# Altium schematic sheet MCU025B_XDS110_MCU.SchDoc
size 431 x 279 mm; PageSetup: Record=PageOptions|CenterHorizontal=True|CenterVertical=True|PrintScale=1.00|XCorrection=1.00|YCorrection=1.00|PrintKind=0|BorderSize=5000000|LeftOffset=0|BottomOffset=0|Orientation=2|PaperLength=1000|PaperWidth=1000|Scale=100|PaperSource=15|PrintQuality=600|MediaType=1|DitherType=10|PaperKind=Letter|PrintScaleMode=1; Organization: ORGANIZATION; Address1: ADDRESS 1; Address2: ADDRESS 2; Address3: ADDRESS 3; Address4: ADDRESS 4; Revision: -; ENG_APP_DATE: --/--/--; DSN_APP_DATE: --/--/--; CHK_APP_DATE: --/--/--
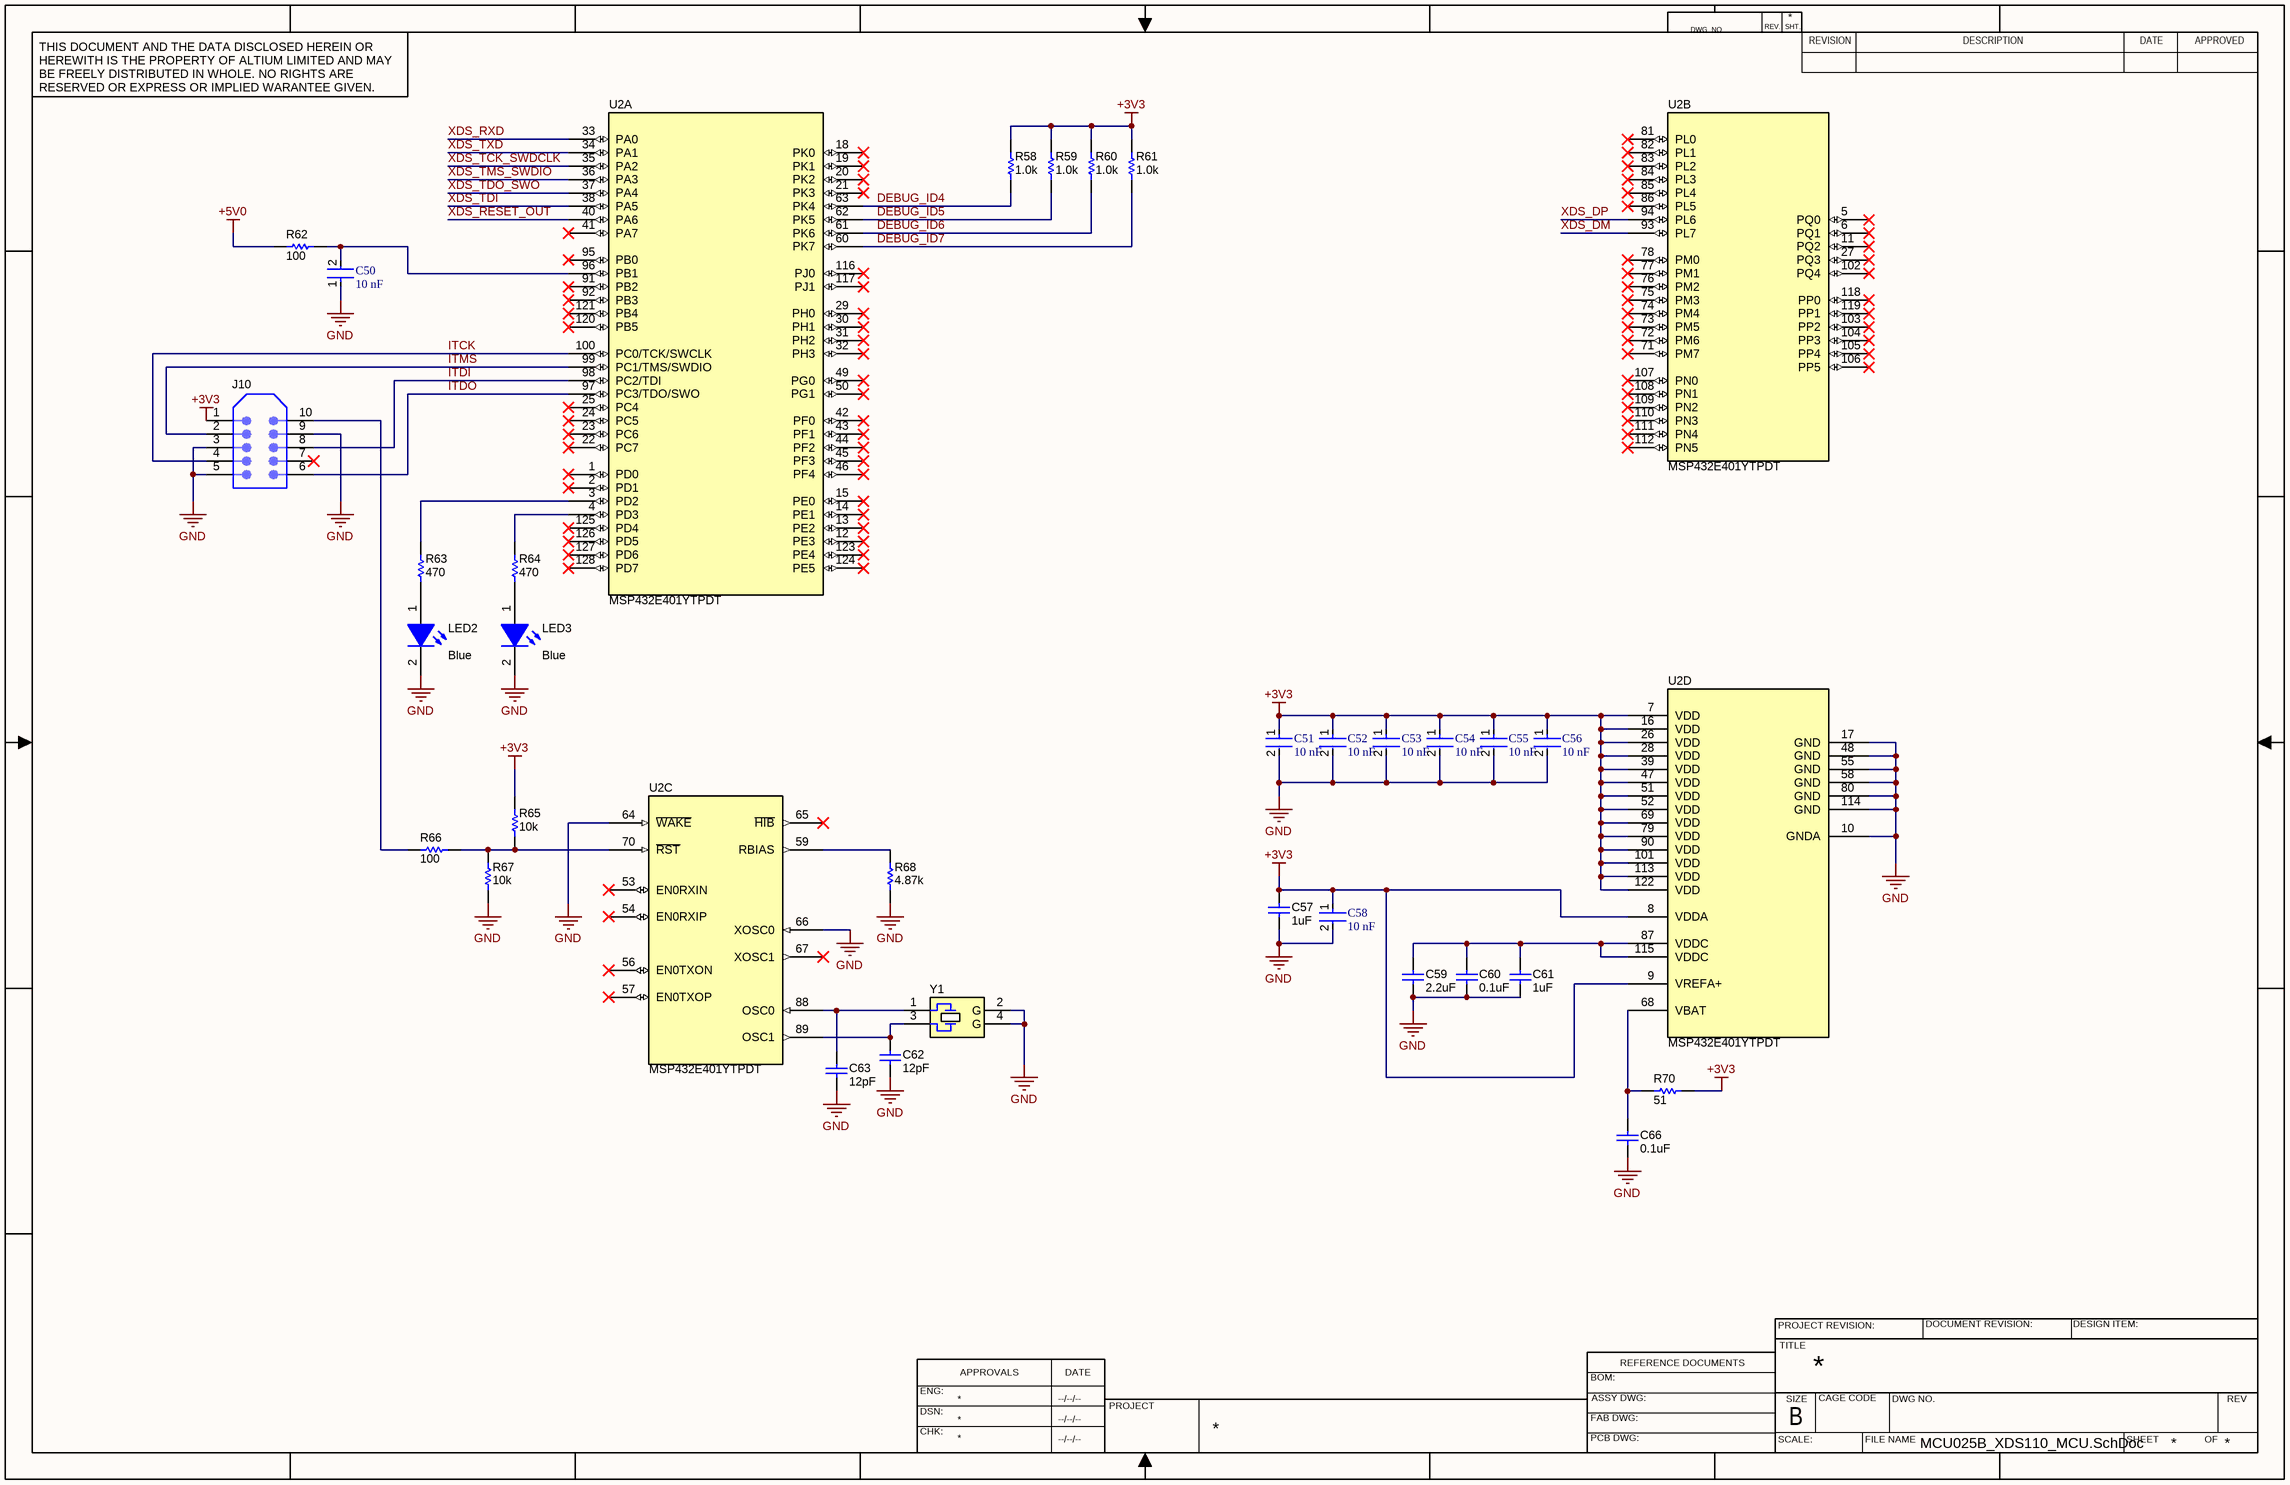
[diagram p0: MCU025B_XDS110_MCU.SchDoc]

## Parts
C50  Capacitance: 10 nF  [FP-CC0603-DA-MFG]  (hidden comment: CC0603KRX7R6BB103)
C51  Capacitance: 10 nF  [FP-CC0603-DA-MFG]  (hidden comment: CC0603KRX7R6BB103)
C52  Capacitance: 10 nF  [FP-CC0603-DA-MFG]  (hidden comment: CC0603KRX7R6BB103)
C53  Capacitance: 10 nF  [FP-CC0603-DA-MFG]  (hidden comment: CC0603KRX7R6BB103)
C54  Capacitance: 10 nF  [FP-CC0603-DA-MFG]  (hidden comment: CC0603KRX7R6BB103)
C55  Capacitance: 10 nF  [FP-CC0603-DA-MFG]  (hidden comment: CC0603KRX7R6BB103)
C56  Capacitance: 10 nF  [FP-CC0603-DA-MFG]  (hidden comment: CC0603KRX7R6BB103)
C57  ValueDisplayed: 1uF  [0402]  (hidden comment: GRM155R61A105KE15D)
C58  Capacitance: 10 nF  [FP-CC0603-DA-MFG]  (hidden comment: CC0603KRX7R6BB103)
C59  ValueDisplayed: 2.2uF  [0402]  (hidden comment: GRM155R60J225KE95D)
C60  ValueDisplayed: 0.1uF  [0402]  (hidden comment: GRM155R70J104KA01D)
C61  ValueDisplayed: 1uF  [0402]  (hidden comment: GRM155R61A105KE15D)
C62  ValueDisplayed: 12pF  [0402]  (hidden comment: GRM1555C1H120JA01D)
C63  ValueDisplayed: 12pF  [0402]  (hidden comment: GRM1555C1H120JA01D)
C66  ValueDisplayed: 0.1uF  [0402]  (hidden comment: GRM155R70J104KA01D)
J10  TC2050-IDC-NL-FP  [Tag_TC2050-NL]  (value not drawn)  (no BOM)
LED2  value Blue  [LTST-C170TBKT_Blue]  (hidden comment: LTST-C170TBKT)
LED3  value Blue  [LTST-C170TBKT_Blue]  (hidden comment: LTST-C170TBKT)
R58  ValueDisplayed: 1.0k  [0402]  (hidden comment: CRCW04021K00JNED)
R59  ValueDisplayed: 1.0k  [0402]  (hidden comment: CRCW04021K00JNED)
R60  ValueDisplayed: 1.0k  [0402]  (hidden comment: CRCW04021K00JNED)
R61  ValueDisplayed: 1.0k  [0402]  (hidden comment: CRCW04021K00JNED)
R62  ValueDisplayed: 100  [0402]  (hidden comment: CRCW0402100RJNED)
R63  ValueDisplayed: 470  [0402]  (hidden comment: ERJ-2RKF4700X)
R64  ValueDisplayed: 470  [0402]  (hidden comment: ERJ-2RKF4700X)
R65  ValueDisplayed: 10k  [0402]  (hidden comment: CRCW040210K0JNED)
R66  ValueDisplayed: 100  [0402]  (hidden comment: CRCW0402100RJNED)
R67  ValueDisplayed: 10k  [0402]  (hidden comment: CRCW040210K0JNED)
R68  ValueDisplayed: 4.87k  [0402]  (hidden comment: CRCW04024K87FKED)
R70  ValueDisplayed: 51  [0402]  (hidden comment: CRCW040251R0JNED)
U2  MSP432E401YTPDT  [PDT0128A]  (parts A,B,C,D of 4)
Y1  NX3225GA-16.000M-STD-CRG-1  [NDK_NX3225GA]  (value not drawn)

## Nets
+3V3: C51.1 C52.1 C53.1 C54.1 C55.1 C56.1 C57.1 C58.1 J10.1 R58.2 R59.2 R60.2 R61.2 R65.2 R70.2 U2.7(VDD) U2.8(VDDA) U2.9(VREFA+) U2.16(VDD) U2.26(VDD) U2.28(VDD) U2.39(VDD) U2.47(VDD) U2.51(VDD) U2.52(VDD) U2.69(VDD) U2.79(VDD) U2.90(VDD) U2.101(VDD) U2.113(VDD) U2.122(VDD)
+5V0: R62.1
GND: C50.1 C51.2 C52.2 C53.2 C54.2 C55.2 C56.2 C57.2 C58.2 C59.2 C60.2 C61.2 C62.2 C63.2 C66.2 J10.3 J10.5 J10.9 LED2.2(K) LED3.2(K) R67.1 R68.1 U2.10(GNDA) U2.17(GND) U2.48(GND) U2.55(GND) U2.58(GND) U2.64(~{WAKE}) U2.66(XOSC0) U2.80(GND) U2.114(GND) Y1.2(GND) Y1.4(GND)
DEBUG_ID4: R58.1 U2.63(PK4)
DEBUG_ID5: R59.1 U2.62(PK5)
DEBUG_ID6: R60.1 U2.61(PK6)
DEBUG_ID7: R61.1 U2.60(PK7)
ITCK: J10.4 U2.100(PC0/TCK/SWCLK)
ITDI: J10.8 U2.98(PC2/TDI)
ITDO: J10.6 U2.97(PC3/TDO/SWO)
ITMS: J10.2 U2.99(PC1/TMS/SWDIO)
XDS_DM: U2.93(PL7)
XDS_DP: U2.94(PL6)
XDS_RESET_OUT: U2.40(PA6)
XDS_RXD: U2.33(PA0)
XDS_TCK_SWDCLK: U2.35(PA2)
XDS_TDI: U2.38(PA5)
XDS_TDO_SWO: U2.37(PA4)
XDS_TMS_SWDIO: U2.36(PA3)
XDS_TXD: U2.34(PA1)
NetC50_2: C50.2 R62.2 U2.96(PB1)
NetC59_1: C59.1 C60.1 C61.1 U2.87(VDDC) U2.115(VDDC)
NetC62_1: C62.1 U2.89(OSC1) Y1.3
NetC63_1: C63.1 U2.88(OSC0) Y1.1
NetC66_1: C66.1 R70.1 U2.68(VBAT)
NetJ10_10: J10.10 R66.1
NetLED2_1: LED2.1(A) R63.1
NetLED3_1: LED3.1(A) R64.1
NetR63_2: R63.2 U2.3(PD2)
NetR64_2: R64.2 U2.4(PD3)
NetR65_1: R65.1 R66.2 R67.2 U2.70(~{RST})
NetR68_2: R68.2 U2.59(RBIAS)

Not connected (* = marked no-connect by the designer): J10 7*; U2 1(PD0)* 2(PD1)* 5(PQ0)* 6(PQ1)* 11(PQ2)* 12(PE3)* 13(PE2)* 14(PE1)* 15(PE0)* 18(PK0)* 19(PK1)* 20(PK2)* 21(PK3)* 22(PC7)* 23(PC6)* 24(PC5)* 25(PC4)* 27(PQ3)* 29(PH0)* 30(PH1)* 31(PH2)* 32(PH3)* 41(PA7)* 42(PF0)* 43(PF1)* 44(PF2)* 45(PF3)* 46(PF4)* 49(PG0)* 50(PG1)* 53(EN0RXIN)* 54(EN0RXIP)* 56(EN0TXON)* 57(EN0TXOP)* 65(~{HIB})* 67(XOSC1)* 71(PM7)* 72(PM6)* 73(PM5)* 74(PM4)* 75(PM3)* 76(PM2)* 77(PM1)* 78(PM0)* 81(PL0)* 82(PL1)* 83(PL2)* 84(PL3)* 85(PL4)* 86(PL5)* 91(PB2)* 92(PB3)* 95(PB0)* 102(PQ4)* 103(PP2)* 104(PP3)* 105(PP4)* 106(PP5)* 107(PN0)* 108(PN1)* 109(PN2)* 110(PN3)* 111(PN4)* 112(PN5)* 116(PJ0)* 117(PJ1)* 118(PP0)* 119(PP1)* 120(PB5)* 121(PB4)* 123(PE4)* 124(PE5)* 125(PD4)* 126(PD5)* 127(PD6)* 128(PD7)*

## Notes on the sheet
- DWG. NO.
- REV.
- SHT.
- THIS DOCUMENT AND THE DATA DISCLOSED HEREIN OR HEREWITH IS THE PROPERTY OF ALTIUM LIMITED AND MAY BE FREELY DISTRIBUTED IN WHOLE. NO RIGHTS ARE RESERVED OR EXPRESS OR IMPLIED WARANTEE GIVEN.
- REVISION
- DESCRIPTION
- DATE
- APPROVED
- APPROVALS
- REFERENCE DOCUMENTS
- PROJECT REVISION:
- TITLE
- DOCUMENT REVISION:
- DESIGN ITEM:
- ENG:
- DSN:
- CHK:
- PROJECT
- BOM:
- FAB DWG:
- PCB DWG:
- ASSY DWG:
- SCALE:
- SIZE
- B
- CAGE CODE
- FILE NAME
- DWG NO.
- SHEET
- OF
- REV
- (in symbol CMP-0004635-3) G

## Library data of the parts
C50-C56 C58 = CMP-03422-000575-1: CAP CER 10000PF 10V X7R 0603; Manufacturer: YAGEO; Tolerance: 0.1; Description: CC0603 10 nF X7R 10.00% 10 V; Temperature Coefficient: 15%; Value: 10 nF; Material: Ceramic; Footprint Url: http://www.yageo.com/exep/pages/download/literatures/UPY-C_GEN_24.pdf; Temperature Characteristic: X7R; Device Class L2: Capacitors; Voltage: 10 V; Octopart: https://octopart.com/cc0603krx7r6bb103-yageo-25629541; Height: 0.9mm; ComponentLink2Description: Datasheet; Manufacturer Part Number: CC0603KRX7R6BB103; Mouser Description: Cap Ceramic 0.01uF 10V X7R 10% SMD 0603 125°C Paper T/R; Voltage Rating: 10 V; Temperature Range High: +125°C; Temperature Range Low: -55°C; ComponentLink2URL: http://www.yageo.com/documents/recent/UPY-GPHC_X7R_6.3V-to-50V_18.pdf; RoHS: TRUE; Automotive: No; Device Class L1: Passive Components; Lead Free: Yes; Digikey Description: CAP CER 10000PF 10V X7R 0603; Package: CC0603-DA; Category: Cap; Temperature: -55°C to +125°C; Device Class L3: Ceramic Capacitors
C57 C61 = CMP-0006563-2: CAP, CERM, 1 uF, 10 V, +/- 10%, X5R, 0402; Manufacturer: MuRata; Polarized: N; Value: 1uF; U/M: EA; Cap_F: 1µF; Value1: Unknown; VDC_V: 10V; TaMin_C: -55°C; TaMax_C: 85°C; SizeArea_mm2: 0.5; SizeAreaWB_mm2: 3; SizeX_mm: 1; SizeZ_mm: 0.6; AEC Category: Q200; CompType: Capacitor; PartNumber: GRM155R61A105KE15D; PackageReference: 0402; RoHS: Y; Tolerance_%: 10%; Value2: 10V; MountType: SMT; Technology: Ceramic; TempCo: X5R; Cap_Case: 0402; SizeY_mm: 0.5; Published: 2008-06-19; Publisher: Texas Instruments; LatestRevisionDate: 2017-03-09; ComponentLink1Description: Datasheet link; ComponentLink1URL: http://search.murata.co.jp/Ceramy/PnsearchViewAction.do?HnOFG=ON&HnNFG=ON&SEL_CNT=50&sLang=en&sKey=GRM155R61A105KE15D&x=9&y=9&search=startwith; Supplier 1: Digi-Key; Supplier Part Number 1: 490-3890-1-ND; Supplier 2: Mouser; Supplier Part Number 2: 81-GRM155R61A105KE15; Supplier 3: Farnell; Supplier Part Number 3: 1735523; AEC Qualified: ?
C59 = CMP-0006543-2: CAP, CERM, 2.2 uF, 6.3 V, +/- 10%, X5R, 0402; Manufacturer: MuRata; Polarized: N; Value: 2.2uF; U/M: EA; Cap_F: 2.2µF; Value1: Unknown; VDC_V: 6.3V; TaMin_C: -55°C; TaMax_C: 85°C; SizeArea_mm2: 0.5; SizeAreaWB_mm2: 3; SizeX_mm: 1; SizeZ_mm: 0.6; AEC Category: Q200; CompType: Capacitor; PartNumber: GRM155R60J225KE95D; PackageReference: 0402; RoHS: Y; Tolerance_%: 10%; Value2: 6.3V; MountType: SMT; Technology: Ceramic; TempCo: X5R; Cap_Case: 0402; SizeY_mm: 0.5; Published: 2008-06-19; Publisher: Texas Instruments; LatestRevisionDate: 2017-03-09; ComponentLink1Description: Datasheet link; ComponentLink1URL: http://psearch.en.murata.com/capacitor/product/GRM155R60J225KE95%23.pdf; Supplier 1: Mouser; Supplier Part Number 1: 81-GRM155R60J225KE5D; AEC Qualified: N; AEC Grade: N/A
C60 C66 = CMP-0006623-2: CAP, CERM, 0.1 uF, 6.3 V, +/- 10%, X7R, 0402; Manufacturer: MuRata; Polarized: N; Value: 0.1uF; U/M: EA; Cap_F: 100nF; Value1: Unknown; VDC_V: 6.3V; TaMin_C: -55°C; TaMax_C: 125°C; SizeArea_mm2: 0.5; SizeAreaWB_mm2: 3; SizeX_mm: 1; SizeZ_mm: 0.6; AEC Category: Q200; CompType: Capacitor; PartNumber: GRM155R70J104KA01D; PackageReference: 0402; RoHS: Y; Tolerance_%: 10%; Value2: 6.3V; MountType: SMT; Technology: Ceramic; TempCo: X7R; Cap_Case: 0402; SizeY_mm: 0.5; Published: 2008-06-19; Publisher: Texas Instruments; LatestRevisionDate: 2017-03-09; ComponentLink1Description: Datasheet link; ComponentLink1URL: http://search.murata.co.jp/Ceramy/PnsearchViewAction.do?HnOFG=ON&HnNFG=ON&SEL_CNT=50&sLang=en&sKey=GRM155R70J104KA01D&x=9&y=9&search=startwith; Supplier 1: Digi-Key; Supplier Part Number 1: GRM155R70J104KA01D-ND; Supplier 2: Mouser; Supplier Part Number 2: 81-GRM155R70J104KA1D; AEC Qualified: ?
C62 C63 = CMP-0006415-2: CAP, CERM, 12 pF, 50 V, +/- 5%, C0G/NP0, 0402; Manufacturer: MuRata; Polarized: N; Value: 12pF; U/M: EA; Value1: Unknown; VDC_V: 50V; TaMin_C: -55°C; TaMax_C: 125°C; SizeArea_mm2: 0.5; SizeAreaWB_mm2: 3; SizeX_mm: 1; SizeZ_mm: 0.6; AEC Category: Q200; CompType: Capacitor; PartNumber: GRM1555C1H120JA01D; PackageReference: 0402; RoHS: Y; Cap_F: 12pF; Tolerance_%: 5%; Value2: 50V; MountType: SMT; Technology: Ceramic; TempCo: C0G/NP0; Cap_Case: 0402; SizeY_mm: 0.5; Published: 2008-06-19; Publisher: Texas Instruments; LatestRevisionDate: 2017-03-09; ComponentLink1Description: Datasheet link; ComponentLink1URL: http://search.murata.co.jp/Ceramy/PnsearchViewAction.do?HnOFG=ON&HnNFG=ON&SEL_CNT=50&sLang=en&sKey=GRM1555C1H120JA01D&x=9&y=9&search=startwith; Supplier 1: Newark; Supplier Part Number 1: 14T3292; Supplier 2: Mouser; Supplier Part Number 2: 81-GRM1555C1H120JA1D; Supplier 3: Farnell; Supplier Part Number 3: 1828875; AEC Qualified: ?
J10 = CMP-0075101-1: Footprint for Tag-Connect TC2050 No-Legs cables; CompType: Receptacle; Note: Footprint only, to mate with Tag-Connect TC2050 No-Legs cables; CNHeader: False; PartNumber: TC2050-IDC-NL-FP; Manufacturer: Tag-Connect; PackageReference: Footprint for TC2050 No Legs series of cables; MountType: N/A; ComponentLink1Description: Datasheet URL; ComponentLink1URL: http://www.tag-connect.com/Materials/TC2050-IDC-430-NL%20Datasheet.pdf; Publisher: Texas Instruments; LatestRevisionDate: 2017-07-12; CT: False
LED2 LED3 = CMP-0002889-1: LED, Blue, SMD; Manufacturer: Lite-On; Type: AlInGaP; Vf_V: 3.3V; Io_A: 20mA; Value1: W; U/M: EA; PartNumber: LTST-C170TBKT; PackageReference: LED_0805; RoHS: Y; CompType: LED; MountType: SMT; Value2: 3.3V; Color: Blue; Published: 2008-07-11; Publisher: Texas Instruments; ComponentLink1URL: http://optoelectronics.liteon.com/upload/download/DS-22-99-0226/S_110_LTST-C170TBKT.pdf; ComponentLink1Description: Datasheet link; LatestRevisionDate: 2017-03-09; Supplier 1: Digi-Key; Supplier Part Number 1: 160-1579-1-ND; Supplier 2: Mouser; Supplier Part Number 2: 859-LTST-C170TBKT
R58-R61 = CMP-0026852-3: RES, 1.0 k, 5%, 0.063 W, AEC-Q200 Grade 0, 0402; Manufacturer: Vishay-Dale; Power_W: 63mW; TempCo: 200 ppm/C; Value_Code: 1k00; Value: 1.0k; EIA_Code: E24; Res_ohm: 1k; SizeX_mm: 1; SizeY_mm: 0.5; SizeZ_mm: 0.6; Value2: 0.063W; AEC Qualified: Y; VDC_V: 50V; AEC Category: Q200; AEC Grade: 0; Supplier Part Number 2: 59M6691; Supplier 2: Newark; Supplier Part Number 3: 71-CRCW0402J-1.0K-E3; Supplier 3: Mouser; RoHS: E; Value1: 5%; MountType: SMT; Supplier 1: Digi-Key; PackageReference: 0402; Tolerance_%: 5%; SizeArea_mm2: 0.5; CompType: Resistor; PartNumber: CRCW04021K00JNED; ComponentLink1Description: Datasheet link; Supplier Part Number 1: 541-1.0KJCT-ND; Technology: Thick Film; ComponentLink1URL: http://www.vishay.com/docs/20035/dcrcwe3.pdf
R62 R66 = CMP-0026824-3: RES, 100, 5%, 0.063 W, AEC-Q200 Grade 0, 0402; Manufacturer: Vishay-Dale; Value: 100; Value_Code: 100R; Power_W: 63mW; Value2: 0.063W; VDC_V: 50V; TempCo: 200 ppm/C; SizeArea_mm2: 0.5; SizeX_mm: 1; SizeZ_mm: 0.6; EIA_Code: E24; AEC Category: Q200; AEC Qualified: Y; AEC Grade: 0; CompType: Resistor; PartNumber: CRCW0402100RJNED; PackageReference: 0402; RoHS: E; Res_ohm: 100; Tolerance_%: 5%; Value1: 5%; MountType: SMT; Technology: Thick Film; SizeY_mm: 0.5; ComponentLink1Description: Datasheet link; ComponentLink1URL: http://www.vishay.com/docs/20035/dcrcwe3.pdf; Supplier 1: Digi-Key; Supplier Part Number 1: 541-100JCT-ND; Supplier 2: Newark; Supplier Part Number 2: 59M6700; Supplier 3: Mouser; Supplier Part Number 3: 71-CRCW0402J-100-E3
R63 R64 = CMP-0026699-1: RES, 470, 1%, 0.1 W, AEC-Q200 Grade 0, 0402; Manufacturer: Panasonic; Value: 470; Value_Code: 470R; Power_W: 100mW; Value2: 0.1W; VDC_V: 50V; TempCo: 100 ppm/C; SizeArea_mm2: 0.5; SizeX_mm: 1; SizeZ_mm: 0.6; U/M: EA; AEC Category: Q200; AEC Qualified: Y; AEC Grade: 0; CompType: Resistor; PartNumber: ERJ-2RKF4700X; PackageReference: 0402; RoHS: Y; Res_ohm: 470; Tolerance_%: 1%; Value1: 1%; MountType: SMT; Technology: Thick Film; SizeY_mm: 0.5; Published: 2008-06-26; Publisher: Texas Instruments; LatestRevisionDate: 2017-03-09; ComponentLink1Description: Datasheet link; ComponentLink1URL: http://industrial.panasonic.com/lecs/www-data/pdf/AOA0000/AOA0000CE2.pdf; Supplier 1: Digi-Key; Supplier Part Number 1: P470LCT-ND; Supplier 2: Mouser; Supplier Part Number 2: 667-ERJ-2RKF4700X; Supplier 3: Farnell; Supplier Part Number 3: 2397145
R65 R67 = CMP-0026825-5: RES, 10 k, 5%, 0.063 W, AEC-Q200 Grade 0, 0402; Manufacturer: Vishay-Dale; Value: 10k; Value_Code: 10k0; Power_W: 63mW; Value2: 0.063W; VDC_V: 50V; TempCo: 200 ppm/C; SizeArea_mm2: 0.5; SizeX_mm: 1; SizeZ_mm: 0.6; EIA_Code: E24; AEC Category: Q200; AEC Qualified: Y; AEC Grade: 0; CompType: Resistor; PartNumber: CRCW040210K0JNED; PackageReference: 0402; RoHS: E; Res_ohm: 10k; Tolerance_%: 5%; Value1: 5%; MountType: SMT; Technology: Thick Film; SizeY_mm: 0.5; ComponentLink1Description: Datasheet link; ComponentLink1URL: http://www.vishay.com/docs/20035/dcrcwe3.pdf; Supplier 1: Digi-Key; Supplier Part Number 1: 541-10KJCT-ND; Supplier 2: Newark; Supplier Part Number 2: 59M6696; Supplier 3: Mouser; Supplier Part Number 3: 71-CRCW0402J-10K-E3
R68 = CMP-0026413-2: RES, 4.87 k, 1%, 0.063 W, AEC-Q200 Grade 0, 0402; Manufacturer: Vishay-Dale; Value: 4.87k; Value_Code: 4k87; Power_W: 63mW; Value2: 0.063W; VDC_V: 50V; TempCo: 100 ppm/C; SizeArea_mm2: 0.5; SizeX_mm: 1; SizeZ_mm: 0.6; EIA_Code: E96; AEC Category: Q200; AEC Qualified: Y; AEC Grade: 0; CompType: Resistor; PartNumber: CRCW04024K87FKED; PackageReference: 0402; RoHS: E; Res_ohm: 4.87k; Tolerance_%: 1%; Value1: 1%; MountType: SMT; Technology: Thick Film; SizeY_mm: 0.5; ComponentLink1Description: Datasheet link; ComponentLink1URL: http://www.vishay.com/docs/20035/dcrcwe3.pdf; Supplier 1: Digi-Key; Supplier Part Number 1: 541-4.87KLCT-ND; Supplier 2: Newark; Supplier Part Number 2: 52K7047; Supplier 3: Mouser; Supplier Part Number 3: 71-CRCW0402-4.87K-E3
R70 = CMP-0026946-3: RES, 51, 5%, 0.063 W, AEC-Q200 Grade 0, 0402; Manufacturer: Vishay-Dale; Value: 51; Value_Code: 51R0; Power_W: 63mW; Value2: 0.063W; VDC_V: 50V; TempCo: 200 ppm/C; SizeArea_mm2: 0.5; SizeX_mm: 1; SizeZ_mm: 0.6; EIA_Code: E24; AEC Category: Q200; AEC Qualified: Y; AEC Grade: 0; CompType: Resistor; PartNumber: CRCW040251R0JNED; PackageReference: 0402; RoHS: E; Res_ohm: 51; Tolerance_%: 5%; Value1: 5%; MountType: SMT; Technology: Thick Film; SizeY_mm: 0.5; ComponentLink1Description: Datasheet link; ComponentLink1URL: http://www.vishay.com/docs/20035/dcrcwe3.pdf; Supplier 1: Digi-Key; Supplier Part Number 1: 541-51JCT-ND; Supplier 2: Newark; Supplier Part Number 2: 72M6804; Supplier 3: Mouser; Supplier Part Number 3: 71-CRCW0402J-51-E3
U2 = CMP-0077953-1: MSP432E401YTPDT, PDT0128A (TQFP-128); Alternate PartNumber: MSP432E401YTPDTR; Alternate Manufacturer: Texas Instruments; SizeAreaWB_mm2: 324; SizeZ_mm: 1.2; SizeX_mm: 16; SizeArea_mm2: 256; CompType: IC; AEC Qualified: N; AEC Category: Q200; ComponentLink1URL: http://www.ti.com/lit/ds/symlink/tm4c129encpdt.pdf; PackageDescription: TQFP-128; MountType: SMT; ComponentLink2URL: TBD; ComponentLink2Description: Product Folder; Manufacturer: Texas Instruments; PackageReference: PDT0128A; SizeY_mm: 16; PartNumber: MSP432E401YTPDT; ComponentLink1Description: Datasheet Link; PartId: 1
Y1 = CMP-0004635-3: Crystal, 16 MHz, 8pF, SMD; Manufacturer: NDK; TaMin_C: -10°C; TaMax_C: 70°C; Frequency Stability: +/-30ppm; Frequency_Fixed: 16MHz; PartNumber: NX3225GA-16.000M-STD-CRG-1; CompType: Crystal; PackageReference: 3.2x0.75x2.5mm; MountType: SMT; RoHS: Y; ComponentLink1Description: Datasheet Link; ComponentLink1URL: http://www.ndk.com/images/products/catalog/c_NX3225GA-STD-CRG-1_e.pdf; Supplier 1: Digi-Key; Supplier Part Number 1: 644-1157-1-ND